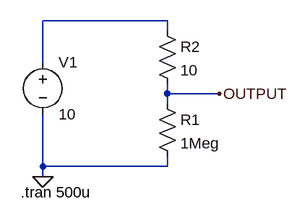
[diagram p0: schematic voltage-divider.asc]
voltage-divider.asc, the LTspice schematic file:
Version 4
SHEET 1 880 680
WIRE 144 64 -48 64
WIRE 144 80 144 64
WIRE -48 128 -48 64
WIRE 144 176 144 160
WIRE 224 176 144 176
WIRE 144 192 144 176
WIRE -48 288 -48 208
WIRE 144 288 144 272
WIRE 144 288 -48 288
WIRE -48 304 -48 288
FLAG 224 176 OUTPUT
FLAG -48 304 0
SYMBOL voltage -48 112 R0
WINDOW 123 0 0 Left 2
WINDOW 39 0 0 Left 2
SYMATTR InstName V1
SYMATTR Value 10
SYMBOL res 128 176 R0
SYMATTR InstName R1
SYMATTR Value 1Meg
SYMBOL res 128 64 R0
SYMATTR InstName R2
SYMATTR Value 10
TEXT -82 328 Left 2 !.tran 500u

The netlist it stands for:
* voltage-divider.asc
V1 N001 0 10
R1 OUTPUT 0 1Meg
R2 N001 OUTPUT 10
.tran 500u
.backanno
.end